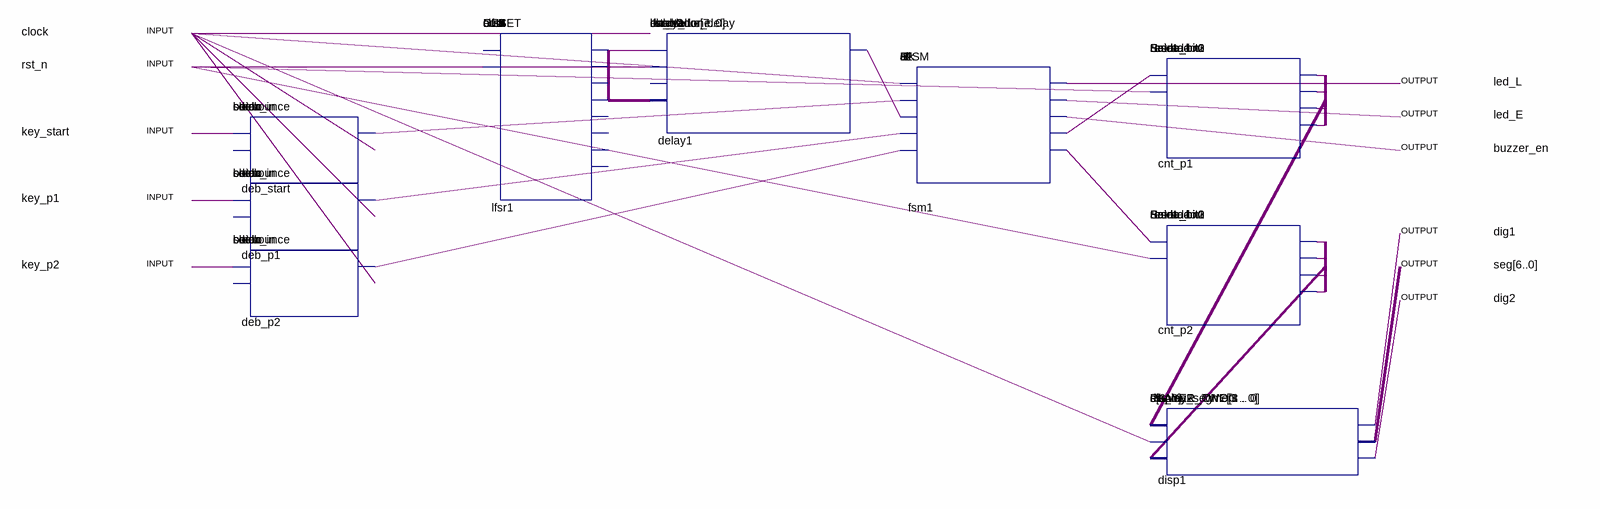
[diagram p0: schematic sheet]
// Quartus schematic montagem_jogo.bdf as structural Verilog: 9 symbols, 11 pins
module montagem_jogo (
  input  clock,
  input  rst_n,
  input  key_start,
  input  key_p1,
  input  key_p2,
  output led_L,
  output led_E,
  output buzzer_en,
  output dig1,
  output [6:0] seg,
  output dig2
);

  wire cnt_p1_saida_bit3, cnt_p2_saida_bit3, deb_p1_saida, deb_p2_saida, deb_start_saida, delay1_dalay_done,
       fsm1_i1, fsm1_i2, undriven;
  wire [3:0] undriven_2, undriven_3;
  wire [7:0] lfsr1_out0;

  debounce deb_start (.botao(key_start), .saida(deb_start_saida));  // open: clock_in
  debounce deb_p1 (.botao(key_p1), .saida(deb_p1_saida));  // open: clock_in
  debounce deb_p2 (.botao(key_p2), .saida(deb_p2_saida));  // open: clock_in
  lfsr lfsr1 (
    .CLK(rst_n), .out0(lfsr1_out0), .out1(rst_n), .out2(lfsr1_out0), .out3(lfsr1_out0), .out5(rst_n));  // open: RESET, out4, out7, out6
  contador_delay delay1 (
    .rst_n9(undriven), .clock3(rst_n), .lfsr_value(lfsr1_out0), .dalay_done(delay1_dalay_done));  // open: enable
  FSM fsm1 (
    .clk(clock), .S(deb_start_saida), .F(delay1_dalay_done), .J1(deb_p1_saida), .J2(deb_p2_saida), .L(led_L),
    .E(led_E), .B(buzzer_en), .I1(fsm1_i1), .I2(fsm1_i2));
  contador cnt_p1 (
    .Entrada(fsm1_i1), .reset(rst_n), .Saida_bit3(cnt_p1_saida_bit3), .Saida_bit2(cnt_p1_saida_bit3),
    .Saida_bit1(cnt_p1_saida_bit3), .Saida_bit0(cnt_p1_saida_bit3));
  contador cnt_p2 (
    .Entrada(fsm1_i2), .reset(rst_n), .Saida_bit3(cnt_p2_saida_bit3), .Saida_bit2(cnt_p2_saida_bit3),
    .Saida_bit1(cnt_p2_saida_bit3), .Saida_bit0(cnt_p2_saida_bit3));
  seven_segment disp1 (
    .PLAYER_ONE(undriven_2), .clk_in(clock), .PLAYER_TWO(undriven_3), .display1(dig1), .s(seg),
    .display2(dig2));
endmodule
